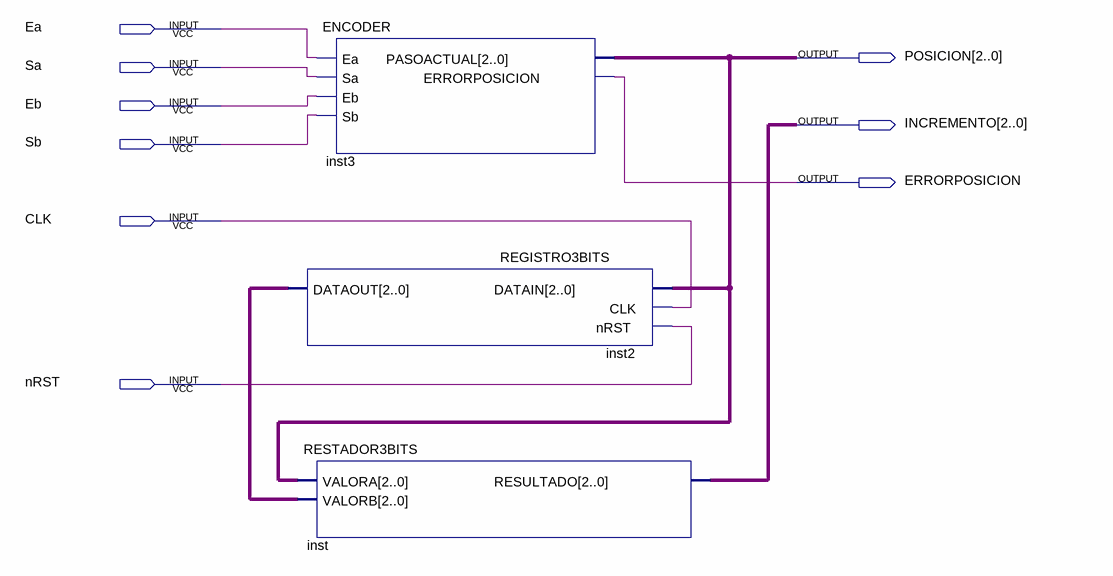
[diagram p0: schematic sheet]
// Quartus schematic VERIFICADOR.bdf as structural Verilog: 3 symbols, 9 pins
module VERIFICADOR (
  input  Ea,
  input  Sa,
  input  Eb,
  input  Sb,
  input  CLK,
  input  nRST,
  output [2:0] POSICION,
  output [2:0] INCREMENTO,
  output ERRORPOSICION
);

  wire [2:0] inst2_dataout;

  ENCODER inst3 (.Ea(Ea), .Sa(Sa), .Eb(Eb), .Sb(Sb), .PASOACTUAL(POSICION), .ERRORPOSICION(ERRORPOSICION));
  REGISTRO3BITS inst2 (.DATAIN(POSICION), .CLK(CLK), .nRST(nRST), .DATAOUT(inst2_dataout));
  RESTADOR3BITS inst (.VALORA(POSICION), .VALORB(inst2_dataout), .RESULTADO(INCREMENTO));
endmodule
